# EAGLE design PF_Dolly_Shield4 (EAGLE 8.2.2)
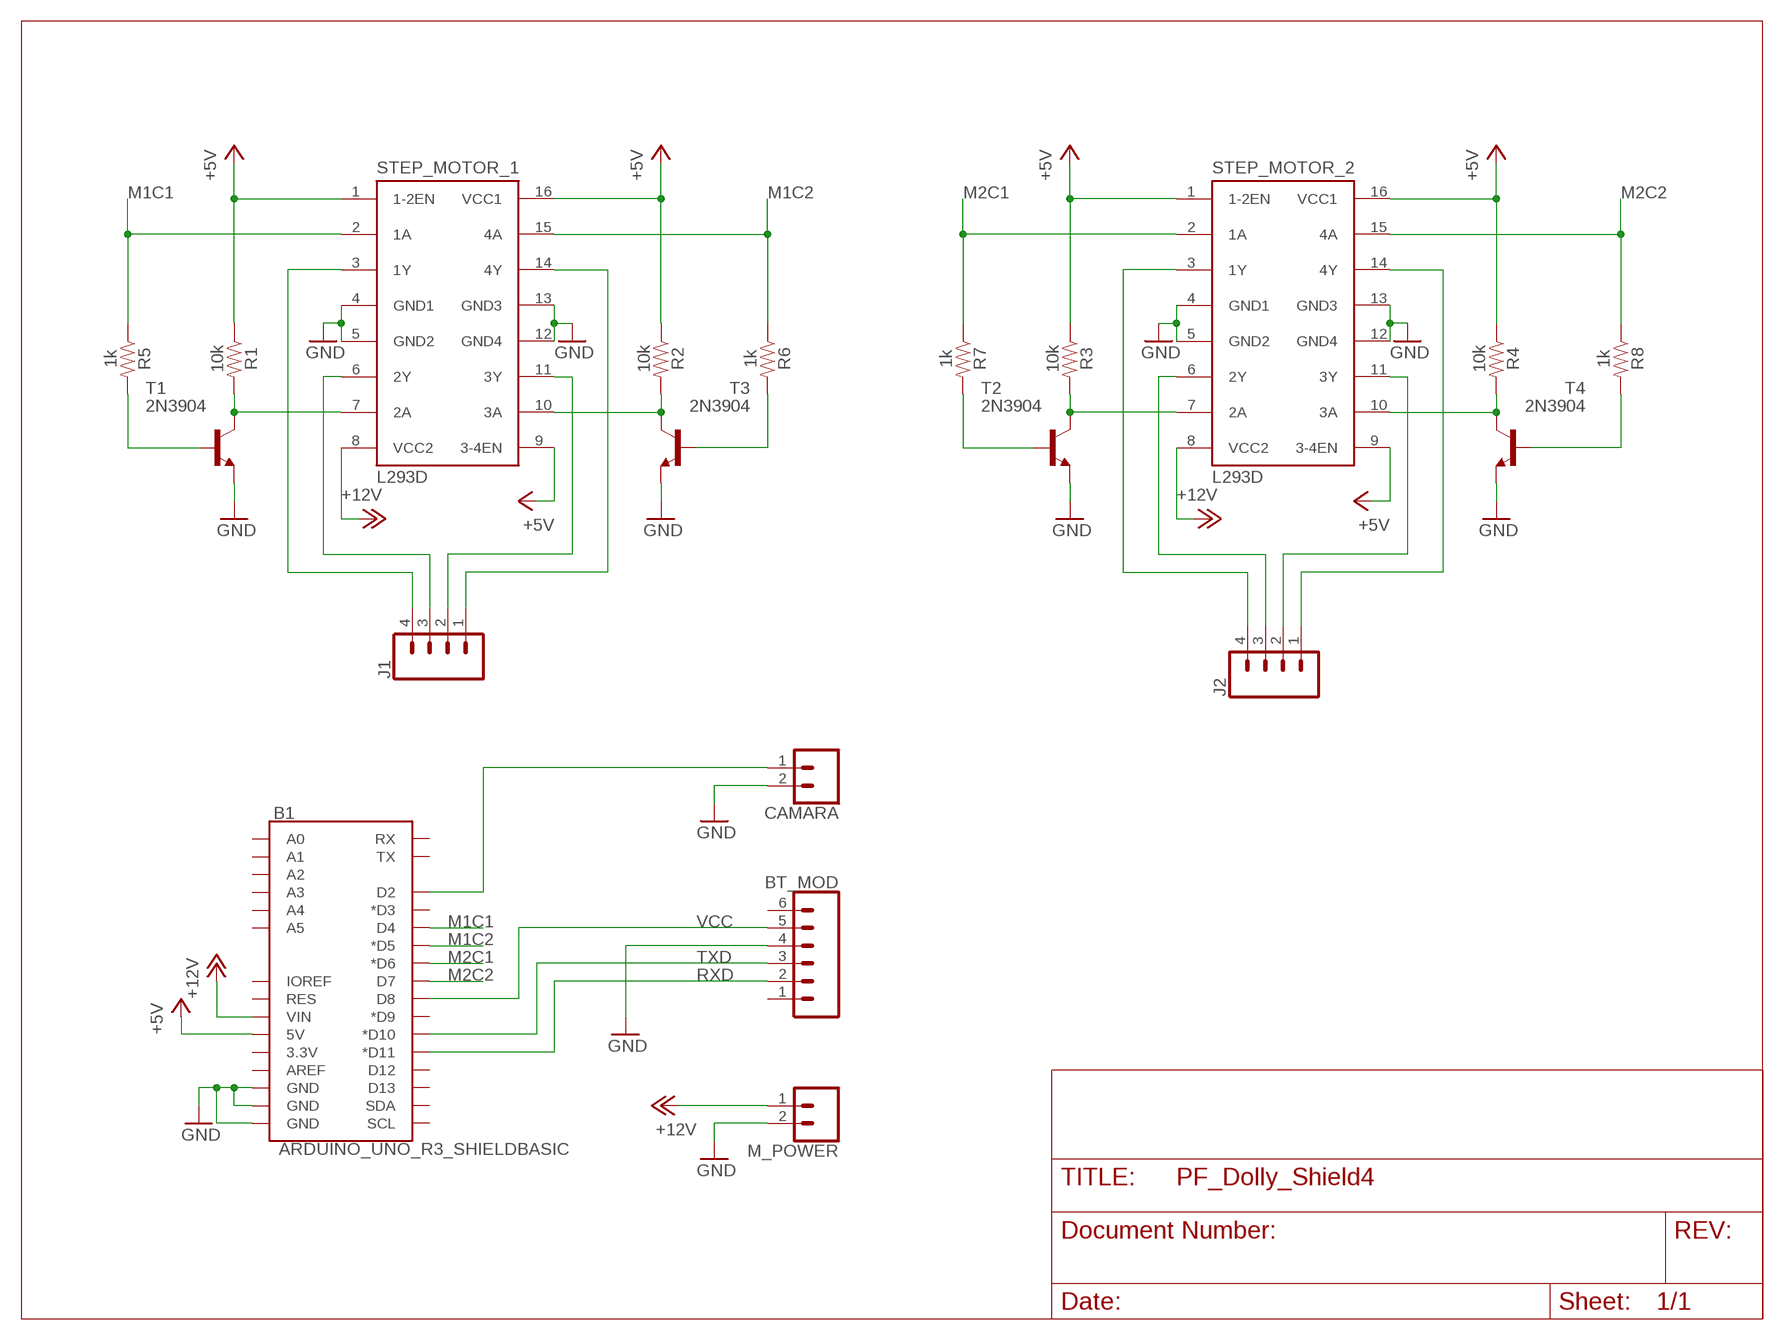
[diagram p0: schematic, sheet 1]

## Parts
B1  ARDUINO_UNO_R3_SHIELDBASIC  [UNO_R3_SHIELD]
BT_MOD  CONN_06LONGPADS  [1X06_LONGPADS]
CAMARA  CONN_025MM  [SCREWTERMINAL-5MM-2]
J1  CONN_04POLAR  [MOLEX-1X4]
J2  CONN_04POLAR  [MOLEX-1X4]
M_POWER  CONN_025MM  [SCREWTERMINAL-5MM-2]
R1  10k  10KOHM-HORIZ-1/4W-5%  [AXIAL-0.3]
R2  10k  10KOHM-HORIZ-1/4W-5%  [AXIAL-0.3]
R3  10k  10KOHM-HORIZ-1/4W-5%  [AXIAL-0.3]
R4  10k  10KOHM-HORIZ-1/4W-5%  [AXIAL-0.3]
R5  1k  1KOHM-HORIZ-1/4W-5%  [AXIAL-0.3]
R6  1k  1KOHM-HORIZ-1/4W-5%  [AXIAL-0.3]
R7  1k  1KOHM-HORIZ-1/4W-5%  [AXIAL-0.3]
R8  1k  1KOHM-HORIZ-1/4W-5%  [AXIAL-0.3]
STEP_MOTOR_1  L293D  [DIL16]
STEP_MOTOR_2  L293D  [DIL16]
T1  2N3904  [TO92]
T2  2N3904  [TO92]
T3  2N3904  [TO92]
T4  2N3904  [TO92]

## Nets
+5V: B1.5V R1.P$1 R2.P$1 R3.P$1 R4.P$1 STEP_MOTOR_1.1(1-2EN) STEP_MOTOR_1.9(3-4EN) STEP_MOTOR_1.16(VCC1) STEP_MOTOR_2.1(1-2EN) STEP_MOTOR_2.9(3-4EN) STEP_MOTOR_2.16(VCC1)
+12V: B1.VIN M_POWER.1 STEP_MOTOR_1.8(VCC2) STEP_MOTOR_2.8(VCC2)
GND: B1.GND@0(GND) B1.GND@1(GND) B1.GND@2(GND) BT_MOD.4 CAMARA.2 M_POWER.2 STEP_MOTOR_1.4(GND1) STEP_MOTOR_1.5(GND2) STEP_MOTOR_1.12(GND4) STEP_MOTOR_1.13(GND3) STEP_MOTOR_2.4(GND1) STEP_MOTOR_2.5(GND2) STEP_MOTOR_2.12(GND4) STEP_MOTOR_2.13(GND3) T1.3(E) T2.3(E) T3.3(E) T4.3(E)
M1C1: B1.D4 R5.P$1 STEP_MOTOR_1.2(1A)
M1C2: B1.D5(*D5) R6.P$1 STEP_MOTOR_1.15(4A)
M2C1: B1.D6(*D6) R7.P$1 STEP_MOTOR_2.2(1A)
M2C2: B1.D7 R8.P$1 STEP_MOTOR_2.15(4A)
N$1: J1.4 STEP_MOTOR_1.3(1Y)
N$2: J1.3 STEP_MOTOR_1.6(2Y)
N$3: J1.2 STEP_MOTOR_1.11(3Y)
N$4: J1.1 STEP_MOTOR_1.14(4Y)
N$5: J2.3 STEP_MOTOR_2.6(2Y)
N$6: J2.2 STEP_MOTOR_2.11(3Y)
N$7: J2.4 STEP_MOTOR_2.3(1Y)
N$8: J2.1 STEP_MOTOR_2.14(4Y)
N$9: R1.P$2 STEP_MOTOR_1.7(2A) T1.1(C)
N$10: R2.P$2 STEP_MOTOR_1.10(3A) T3.1(C)
N$11: R3.P$2 STEP_MOTOR_2.7(2A) T2.1(C)
N$12: R4.P$2 STEP_MOTOR_2.10(3A) T4.1(C)
N$13: R5.P$2 T1.2(B)
N$14: R6.P$2 T3.2(B)
N$15: R7.P$2 T2.2(B)
N$16: R8.P$2 T4.2(B)
N$17: B1.D2 CAMARA.1
RXD: B1.D11(*D11) BT_MOD.2
TXD: B1.D10(*D10) BT_MOD.3
VCC: B1.D8 BT_MOD.5
Unconnected: B1.3.3V B1.A0 B1.A1 B1.A2 B1.A3 B1.A4 B1.A5 B1.AREF B1.D3(*D3) B1.D9(*D9) B1.D12 B1.D13 B1.IOREF B1.RES B1.RX B1.SCL B1.SDA B1.TX BT_MOD.1 BT_MOD.6

## Library data of the parts
B1 = SparkFun-Boards:ARDUINO_UNO_R3_SHIELD: Arduino R3 Shield Footprint Shield form compatible with the Arduino Uno R3. SparkFun Products: MG2639 Cellular Shield <https://www.sparkfun.com/products/13120> MIDI Shield <https://www.sparkfun.com/products/12898> R3 Stackable Headers Kit <https://www.sparkfun.com/products/11417>
BT_MOD = SparkFun-Connectors:CONN_06: Multi connection point. Often used as Generic Header-pin footprint for 0.1 inch spaced/style header connections On any of the 0.1 inch spaced packages, you can populate with these: Break Away Headers - Straight <https://www.sparkfun.com/products/116> (PRT-00116) Break Away Male Headers - Right Angle <https://www.sparkfun.com/products/553> (PRT-00553) Female Headers <https://www.sparkfun.com/products/115> (PRT-00115) Break Away Headers - Machine Pin <https://www.sparkfun.com/products/117> (PRT-00117) Break Away Female Headers - Swiss Machine Pin <https://www.sparkfun.com/products/743> (PRT-00743) Arduino Stackable Header - 6 Pin <https://www.sparkfun.com/products/9280> (PRT-09280) For SCREWTERMINALS and SPRING TERMINALS visit here: Screw Terimnals on SparkFun.com <https://www.sparkfun.com/search/results?term=Screw+Terminals> (5mm/3.5mm/2.54mm spacing) This device is also useful as a general connection point to wire up your design to another part of your project. Our various solder wires solder well into these plated through hole pads. Hook-Up Wire - Assortment (Stranded, 22 AWG) <https://www.sparkfun.com/products/11375> (PRT-11375) Hook-Up Wire - Assortment (Solid Core, 22 AWG) <https://www.sparkfun.com/products/11367> (PRT-11367) View the entire wire category on our website here <https://www.sparkfun.com/categories/141>
CAMARA M_POWER = SparkFun-Connectors:CONN_02: Multi connection point. Often used as Generic Header-pin footprint for 0.1 inch spaced/style header connections On any of the 0.1 inch spaced packages, you can populate with these: Break Away Headers - Straight <https://www.sparkfun.com/products/116> (PRT-00116) Break Away Male Headers - Right Angle <https://www.sparkfun.com/products/553> (PRT-00553) Female Headers <https://www.sparkfun.com/products/115> (PRT-00115) Break Away Headers - Machine Pin <https://www.sparkfun.com/products/117> (PRT-00117) Break Away Female Headers - Swiss Machine Pin <https://www.sparkfun.com/products/743> (PRT-00743) For SCREWTERMINALS and SPRING TERMINALS visit here: Screw Terimnals on SparkFun.com <https://www.sparkfun.com/search/results?term=Screw+Terminals> (5mm/3.5mm/2.54mm spacing) This device is also useful as a general connection point to wire up your design to another part of your project. Our various solder wires solder well into these plated through hole pads. Hook-Up Wire - Assortment (Stranded, 22 AWG) <https://www.sparkfun.com/products/11375> (PRT-11375) Hook-Up Wire - Assortment (Solid Core, 22 AWG) <https://www.sparkfun.com/products/11367> (PRT-11367) View the entire wire category on our website here <https://www.sparkfun.com/categories/141> Special notes: Molex polarized connector foot print use with: PRT-08233 with associated crimp pins and housings. 2.54_SCREWTERM for use with PRT-10571. 3.5mm Screw Terminal footprints for PRT-08084 5mm Screw Terminal footprints for use with PRT-08432; SF_SKU: PRT-08432
J1 J2 = SparkFun-Connectors:CONN_04: Multi connection point. Often used as Generic Header-pin footprint for 0.1 inch spaced/style header connections On any of the 0.1 inch spaced packages, you can populate with these: Break Away Headers - Straight <https://www.sparkfun.com/products/116> (PRT-00116) Break Away Male Headers - Right Angle <https://www.sparkfun.com/products/553> (PRT-00553) Female Headers <https://www.sparkfun.com/products/115> (PRT-00115) Break Away Headers - Machine Pin <https://www.sparkfun.com/products/117> (PRT-00117) Break Away Female Headers - Swiss Machine Pin <https://www.sparkfun.com/products/743> (PRT-00743) For SCREWTERMINALS and SPRING TERMINALS visit here: Screw Terimnals on SparkFun.com <https://www.sparkfun.com/search/results?term=Screw+Terminals> (5mm/3.5mm/2.54mm spacing) This device is also useful as a general connection point to wire up your design to another part of your project. Our various solder wires solder well into these plated through hole pads. Hook-Up Wire - Assortment (Stranded, 22 AWG) <https://www.sparkfun.com/products/11375> (PRT-11375) Hook-Up Wire - Assortment (Solid Core, 22 AWG) <https://www.sparkfun.com/products/11367> (PRT-11367) View the entire wire category on our website here <https://www.sparkfun.com/categories/141> Special notes: Molex polarized connector foot print use with SKU : PRT-08231 with associated crimp pins and housings. 1MM SMD Version SKU: PRT-10208; PROD_ID: CONN-08186; SF_ID: PRT-08231
R1-R4 = SparkFun-Resistors:10KOHM: 10kΩ resistor A resistor is a passive two-terminal electrical component that implements electrical resistance as a circuit element. Resistors act to reduce current flow, and, at the same time, act to lower voltage levels within circuits. - Wikipedia; PROD_ID: RES-09435
R5-R8 = SparkFun-Resistors:1KOHM: 1kΩ resistor A resistor is a passive two-terminal electrical component that implements electrical resistance as a circuit element. Resistors act to reduce current flow, and, at the same time, act to lower voltage levels within circuits. - Wikipedia; PROD_ID: RES-08380
STEP_MOTOR_1 STEP_MOTOR_2 = st-microelectronics:L293D: PUSH-PULL 4 CHANNEL DRIVER; MPN: L293D; OC_FARNELL: 9589619; OC_NEWARK: 56P8249
T1-T4 = transistor:2N3904: NPN TRANSISTOR

## Board
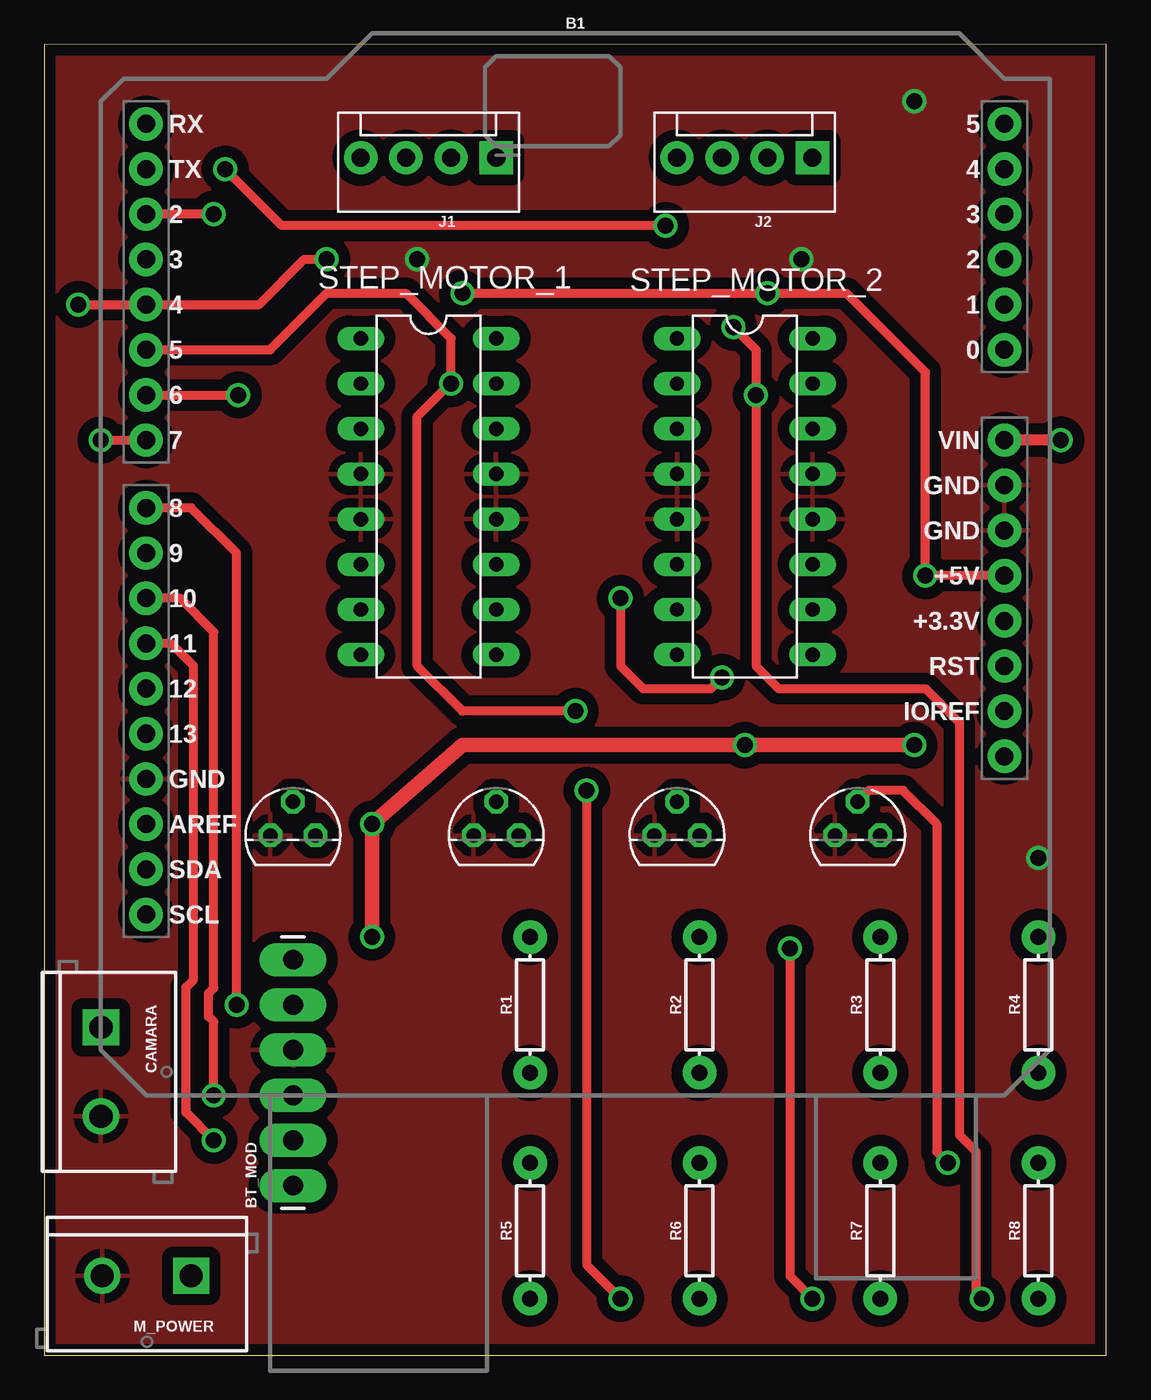
[diagram p1: board, top side]
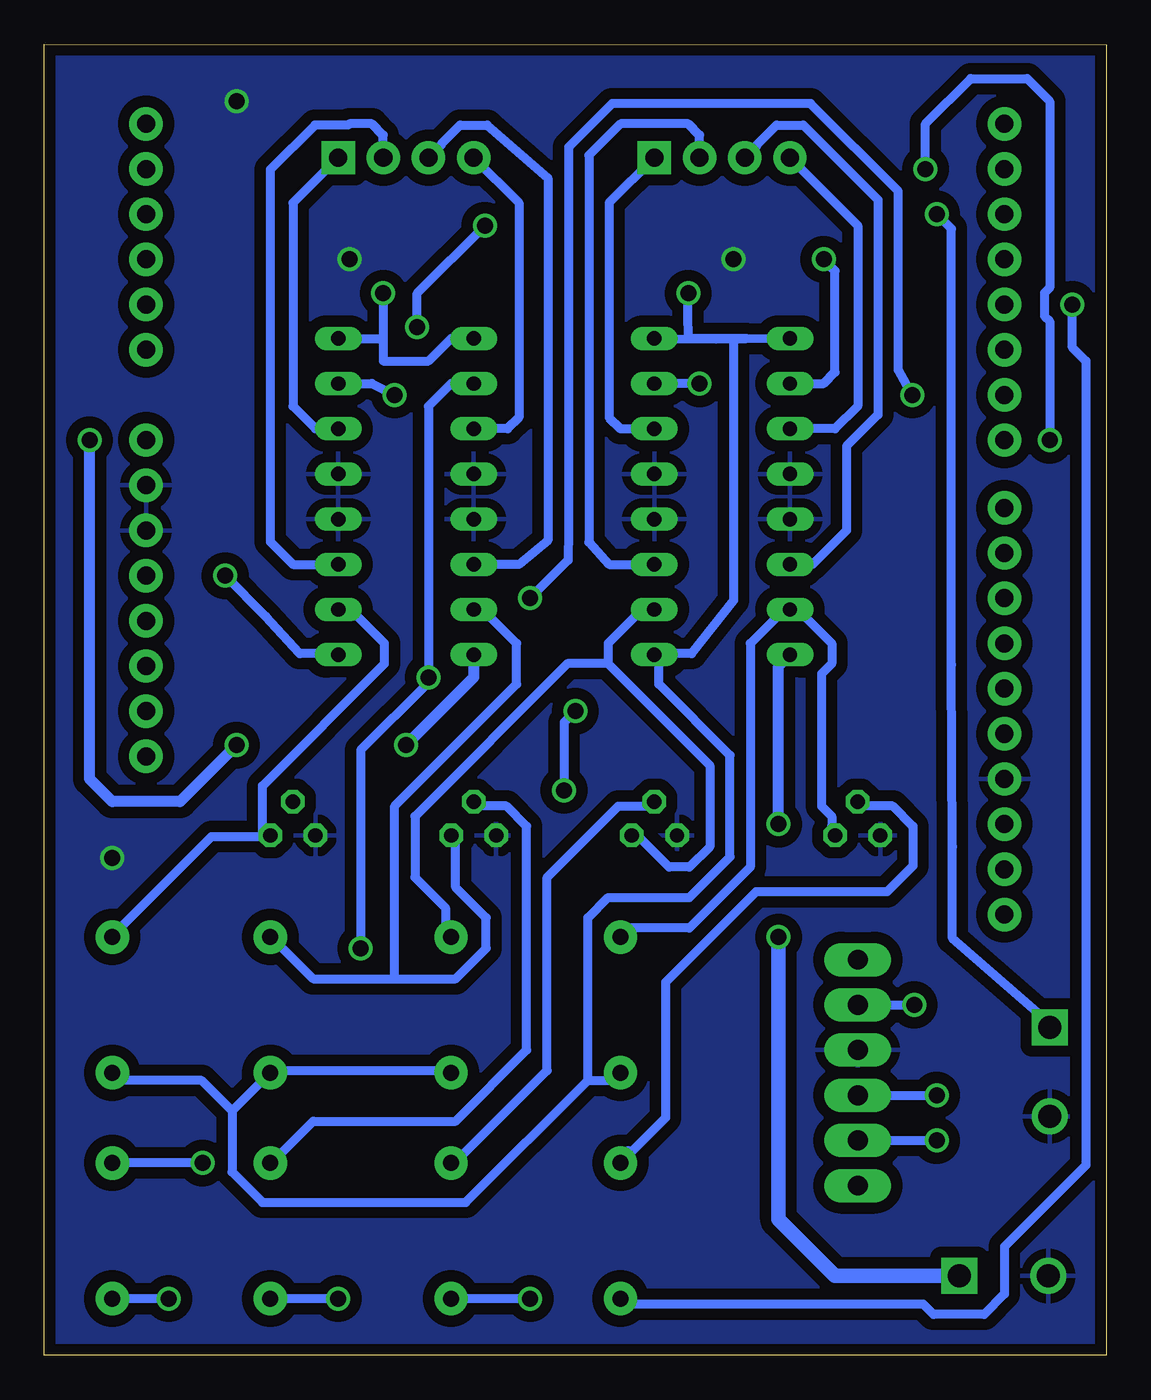
[diagram p2: board, bottom side, seen from below]

Size 59.69 x 73.68 mm. Coordinates in mm from the lower left corner, seen from the top.
Outline: 0,0 59.69,0 59.69,73.67 0,73.65 0,0
Copper layers (1*16): Top 0.035mm / dielectric 1.5mm / Bottom 0.035mm
Design rules "default *": minimum track width 20mil, minimum drill 0.6mm, track to track 25mil, track to pad 25mil, pad to pad 25mil, via to via 25mil, smd to smd 25mil, copper to edge 25mil, drill to drill 25mil, minimum pad ring 10mil, minimum via ring 8mil, stop-mask expansion 4mil, vias tented up to drill 0mil, thermal gap 20mil

### Footprints (pad centres in the part's own frame; a part is rotated, then mirrored left to right if it is on the bottom)
UNO_R3_SHIELD = drill 1.016 pad 1.88: 3.3V 24.13,-2.54; 5V 24.13,0; A0 24.13,12.7; A1 24.13,15.24; A2 24.13,17.78; A3 24.13,20.32; A4 24.13,22.86; A5 24.13,25.4; AREF -24.13,-13.97; D2 -24.13,20.32; D3 -24.13,17.78; D4 -24.13,15.24; D5 -24.13,12.7; D6 -24.13,10.16; D7 -24.13,7.62; D8 -24.13,3.81; D9 -24.13,1.27; D10 -24.13,-1.27; D11 -24.13,-3.81; D12 -24.13,-6.35; D13 -24.13,-8.89; GND@0 24.13,2.54; GND@1 24.13,5.08; GND@2 -24.13,-11.43; IOREF 24.13,-7.62; NC 24.13,-10.16; RES 24.13,-5.08; RX -24.13,25.4; SCL -24.13,-19.05; SDA -24.13,-16.51; TX -24.13,22.86; VIN 24.13,7.62
1X06_LONGPADS = drill 1.118 pad 1.88 long: 1 0,0; 2 2.54,0; 3 5.08,0; 4 7.62,0; 5 10.16,0; 6 12.7,0
SCREWTERMINAL-5MM-2 = drill 1.3 pad 2.032 square: 1 0,0 | drill 1.3 pad 2.032: 2 5,0
MOLEX-1X4 = drill 1.016 pad 1.88 square: 1 0,0 | drill 1.016 pad 1.88: 2 2.54,0; 3 5.08,0; 4 7.62,0
AXIAL-0.3 = drill 0.9 pad 1.88: P$1 -3.81,0; P$2 3.81,0
DIL16 = drill 0.813 long: 1 -8.89,-3.81; 2 -6.35,-3.81; 3 -3.81,-3.81; 4 -1.27,-3.81; 5 1.27,-3.81; 6 3.81,-3.81; 7 6.35,-3.81; 8 8.89,-3.81; 9 8.89,3.81; 10 6.35,3.81; 11 3.81,3.81; 12 1.27,3.81; 13 -1.27,3.81; 14 -3.81,3.81; 15 -6.35,3.81; 16 -8.89,3.81
TO92 = drill 0.813 octagon: 1 1.27,0; 2 0,1.905; 3 -1.27,0

### Placement (x,y rotation side)
B1  29.84,43.81 0 top
BT_MOD  13.97,9.53 90 top
CAMARA  3.17,18.41 270 top
J1  25.4,67.31 180 top
J2  43.18,67.31 180 top
M_POWER  8.26,4.45 180 top
R1  27.3,19.68 90 top
R2  36.83,19.68 90 top
R3  46.99,19.68 90 top
R4  55.88,19.68 90 top
R5  27.3,6.99 90 top
R6  36.83,6.99 90 top
R7  46.99,6.99 90 top
R8  55.88,6.99 90 top
STEP_MOTOR_1  21.59,48.26 270 top
STEP_MOTOR_2  39.37,48.26 270 top
T1  13.97,29.21 0 top
T2  35.56,29.21 0 top
T3  25.4,29.21 0 top
T4  45.72,29.21 0 top

### Tracks (layer width: path | path; a pad name or v marks a point on that pad's centre or on a via)
+5V  (via drill 0.9 pad 1.3)
  Top 0.508: v23.5,59.69 v40.64,59.69 45.09,59.69 49.53,55.24 v49.53,43.81 B1.5V
  Bottom 0.508: STEP_MOTOR_2.9 43.43,39.43 45.34,39.43 47.24,41.53 v49.53,43.81 | STEP_MOTOR_2.16 40.64,57.15 | 20.94,57.12 20.95,55.44 20.95,42.42 23.3,39.43 25.15,39.43 STEP_MOTOR_1.9 25.15,38.86 25.15,37.72 21.14,33.72 21.14,28 23.43,25.72 28,25.72 29.15,24.57 29.15,15.43 | STEP_MOTOR_1.16 20.94,57.12 | STEP_MOTOR_1.1 21.93,57.12 20.23,57.15 | 29.15,15.43 27.43,15.43 R1.P$1 | 29.15,15.43 36.01,8.57 47.43,8.57 49.15,10.29 49.15,13.72 | 49.15,13.72 R3.P$1 46.86,16 37.15,16 R2.P$1 | 49.15,13.72 50.86,15.43 55.44,15.43 R4.P$1 | v40.64,59.69 40.64,57.15 | v23.5,59.69 23.52,58.55 23.5,57.14 20.23,57.15 | 20.23,57.15 20.94,57.12 | 40.64,57.15 40.64,55.88 38.1,55.88 36.83,57.15 STEP_MOTOR_2.1
+12V  (via drill 0.9 pad 1.3)
  Top 0.61: v57.15,51.44 B1.VIN
  Top 0.813: v18.41,23.5 v18.41,29.84 23.5,34.29 v39.37,34.29 v48.9,34.29
  Bottom 0.61: v48.9,34.29 52.07,31.11 55.88,31.11 57.15,32.38 v57.15,51.44 | STEP_MOTOR_2.8 35.56,38.1 v39.37,34.29 | v18.41,29.84 18.41,38.73 STEP_MOTOR_1.8
  Bottom 0.813: M_POWER.1 15.24,4.45 18.41,7.62 v18.41,23.5
GND  (via drill 0.9 pad 1.3)
  other vias: 48.9,70.48 55.88,27.94 20.95,61.59 42.55,61.59
  pour Bottom: -8.89,76.2 63.5,76.2 63.5,-1.27 -8.89,-1.27
  pour Top: -8.89,77.47 63.5,77.47 63.5,-2.54 -8.89,-2.54
M1C1  (via drill 0.9 pad 1.3)
  Top 0.508: v1.91,59.05 B1.D4 12.06,59.05 14.61,61.59 v15.88,61.59
  Bottom 0.508: R5.P$1 26.86,2.86 10.29,2.86 9.72,2.29 6.86,2.29 5.71,3.43 5.71,6.1 1.14,10.67 1.14,55.88 1.91,56.64 v1.91,59.05 | 5.31,59.03 B1.D4 | STEP_MOTOR_1.2 15.88,54.61 15.24,55.24 15.24,60.96 v15.88,61.59
M1C2  (via drill 0.9 pad 1.3)
  Top 0.508: B1.D5 12.7,56.52 15.88,59.69 20.32,59.69 22.86,57.15 22.86,54.67 | 22.86,54.67 v22.86,54.61 | v29.84,36.2 23.5,36.2 20.95,38.73 20.95,52.76 22.86,54.67 | v30.48,31.75 30.48,5.08 v32.38,3.17
  Bottom 0.508: v22.86,54.61 STEP_MOTOR_1.15 | v29.84,36.2 30.48,35.56 v30.48,31.75 | v32.38,3.17 R6.P$1
M2C1  (via drill 0.9 pad 1.3)
  Top 0.508: B1.D6 v10.9,53.98 | v32.38,42.55 32.38,38.73 33.66,37.47 37.47,37.47 v38.1,38.1 | v43.18,3.17 41.91,4.45 v41.91,22.86
  Bottom 0.508: v10.9,53.98 11.68,55.4 11.68,65.42 16.62,70.36 27.78,70.36 30.23,67.91 30.23,45.72 30.25,45.27 30.25,44.69 v32.38,42.55 | STEP_MOTOR_2.2 36.83,54.61 38.1,53.34 v38.1,38.1 38.16,38.04 38.16,37.75 41.91,34.01 v41.91,22.86 | v43.18,3.17 R7.P$1
M2C2  (via drill 0.9 pad 1.3)
  Top 0.508: v38.73,57.78 40.01,56.52 v40.01,53.98 40.01,38.73 41.27,37.47 49.53,37.47 51.44,35.56 51.44,12.37 52.36,11.44 52.36,3.52 v52.7,3.17 | v34.92,63.5 13.34,63.5 v10.16,66.67 | v3.17,51.44 B1.D7
  Bottom 0.508: v38.73,57.78 38.73,59.69 v34.92,63.5 | v10.16,66.67 10.16,69.22 7.62,71.75 4.45,71.75 3.17,70.48 3.17,60 3.47,59.7 3.47,58.41 3.17,58.11 v3.17,51.44 | STEP_MOTOR_2.15 41.27,54.61 v40.01,53.98 | v52.7,3.17 R8.P$1
N$1
  Bottom 0.508: J1.4 13.97,63.5 13.97,53.34 15.24,52.07 STEP_MOTOR_1.3
N$2
  Bottom 0.508: J1.3 19.61,68.02 19.61,68.07 18.54,69.14 17.02,69.14 12.83,64.94 12.83,52.87 14.61,51.09 14.61,46.35 16.51,44.45 STEP_MOTOR_1.6
N$3
  Bottom 0.508: J1.2 22.86,68.58 23.5,69.22 27.3,69.22 29.08,67.44 29.08,45.7 27.94,44.45 STEP_MOTOR_1.11
N$4
  Bottom 0.508: J1.1 27.94,64.77 27.94,52.7 27.3,52.07 STEP_MOTOR_1.14
N$5
  Bottom 0.508: J2.3 37.39,68.02 37.39,68.07 36.32,69.14 34.8,69.14 31.39,66.16 31.39,45.8 33.02,44.45 STEP_MOTOR_2.6
N$6
  Bottom 0.508: J2.2 40.64,68.58 41.27,69.22 42.55,69.22 42.62,69.14 44.49,69.14 46.99,66.64 46.99,45.72 45.72,44.45 STEP_MOTOR_2.11
N$7
  Bottom 0.508: J2.4 33.02,64.77 33.02,52.7 33.66,52.07 STEP_MOTOR_2.3
N$8
  Bottom 0.508: J2.1 45.72,64.77 45.72,53.34 44.45,52.07 STEP_MOTOR_2.14
N$9
  Bottom 0.508: T1.1 15.43,29.72 15.43,30.29 16,30.86 16,38.29 15.43,38.86 15.43,40.01 17.72,42.29 STEP_MOTOR_1.7 18.29,41.72 20,40.01 20,27.43 23.43,24 26.86,24 R1.P$2
N$10
  Bottom 0.508: 28,38.86 22.29,33.15 22.29,28.57 23.43,27.43 24.57,27.43 26.29,29.15 T3.1 | 28,38.86 28,40.01 25.72,42.29 STEP_MOTOR_1.10 | 28,38.86 30.29,38.86 38.86,30.29 38.86,26.86 37.15,25.15 37.15,24 R2.P$2
N$11
  Bottom 0.508: 40.01,21.14 44.58,21.14 46.86,23.43 R3.P$2 | 40.01,21.14 36.58,21.14 34.86,22.86 34.86,24.57 36.58,26.29 36.58,29.15 T2.1 | 40.01,21.14 40.01,30.86 33.15,37.72 33.15,40.01 34.86,41.72 35.43,41.72 STEP_MOTOR_2.7
N$12
  Bottom 0.508: 47.43,29.15 50.29,29.15 55.44,24 R4.P$2 | 47.43,29.15 47.43,32 40.58,38.86 40.58,40.01 42.29,41.72 42.86,41.72 STEP_MOTOR_2.10 | 47.43,29.15 T4.1
N$13
  Bottom 0.508: T1.2 13.72,30.86 12,30.86 10.86,29.72 10.86,27.5 12.32,26.04 19.68,26.04 24.77,20.95 24.77,13.34 27.04,11.06 27.14,11.06 | 27.14,11.06 26.86,11.49 | 27.14,11.06 R5.P$2
N$14
  Bottom 0.508: T3.2 25.72,30.86 27.43,30.86 31.43,26.86 31.43,16 36.58,10.86 R6.P$2
N$15
  Bottom 0.508: T2.2 35.43,30.86 33.72,30.86 32.58,29.72 32.58,17.14 36.58,13.14 44.58,13.14 46.86,10.86 R7.P$2
N$16  (via drill 0.9 pad 1.3)
  Top 0.508: v50.8,10.79 50.16,11.43 50.16,29.84 48.26,31.75 46.35,31.75 T4.2
  Bottom 0.508: v50.8,10.79 R8.P$2
N$17  (via drill 0.9 pad 1.3)
  Top 0.508: v9.53,64.14 B1.D2
  Bottom 0.508: CAMARA.1 3.43,18.86 8.64,23.43 8.64,28.57 8.7,38.8 8.7,63.31 v9.53,64.14
RXD  (via drill 0.9 pad 1.3)
  Top 0.508: v9.53,12.06 7.96,13.63 7.96,20.68 8.38,21.1 8.38,38.73 7.11,40.01 B1.D11
  Bottom 0.508: BT_MOD.2 v9.53,12.06
TXD  (via drill 0.9 pad 1.3)
  Top 0.508: v9.53,14.61 9.53,18.74 9.23,19.04 9.23,20.33 9.53,20.63 9.53,40.64 7.62,42.55 B1.D10
  Bottom 0.508: BT_MOD.3 v9.53,14.61
VCC  (via drill 0.9 pad 1.3)
  Top 0.508: B1.D8 8.26,47.62 10.79,45.09 v10.79,19.68
  Bottom 0.508: BT_MOD.5 v10.79,19.68